# EAGLE design display_in4 (EAGLE 6.2)
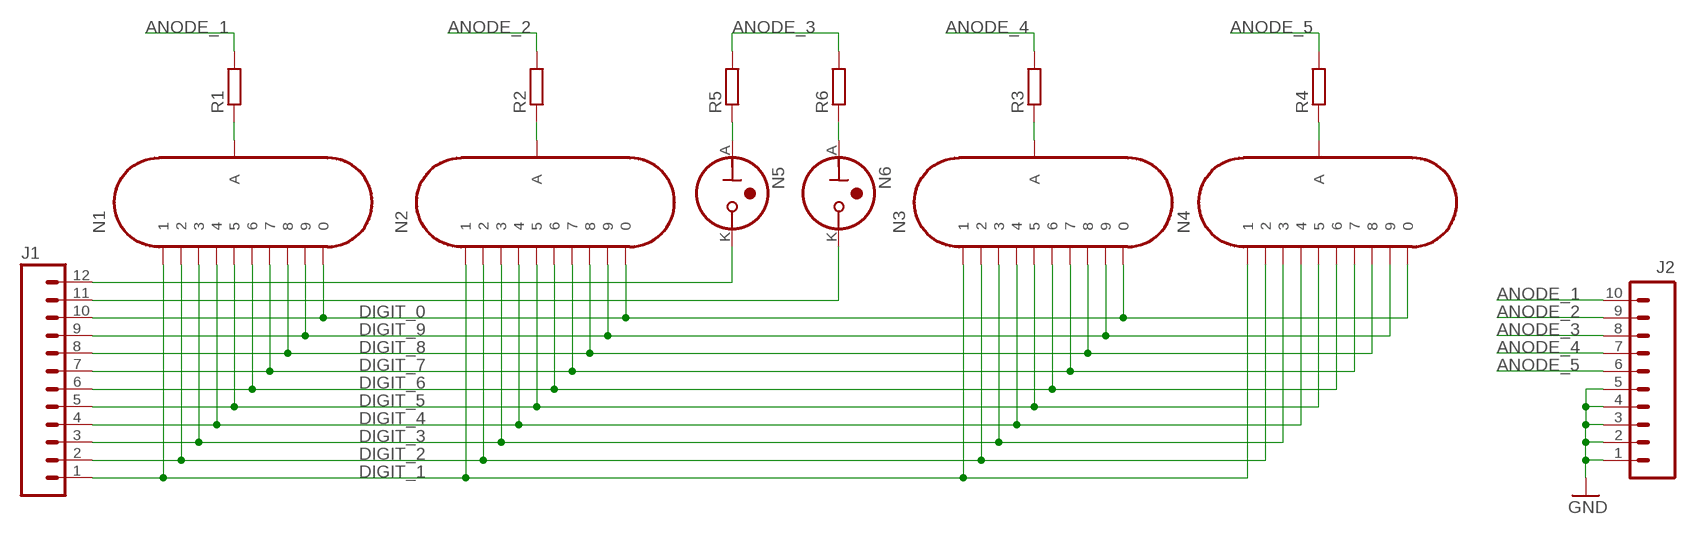
[diagram p0: schematic, sheet 1]

## Parts
J1  M12LOCK  [1X12_LOCK]
J2  M10LOCK  [1X10_LOCK]
N1  IN-4  [IN-4]
N2  IN-4  [IN-4]
N3  IN-4  [IN-4]
N4  IN-4  [IN-4]
N5  IN-6  [IN-6]
N6  IN-6  [IN-6]
R1  R-EU_0204/7  [0204/7]
R2  R-EU_0204/7  [0204/7]
R3  R-EU_0204/7  [0204/7]
R4  R-EU_0204/7  [0204/7]
R5  R-EU_0204/7  [0204/7]
R6  R-EU_0204/7  [0204/7]

## Nets
ANODE_1: J2.10 R1.2
ANODE_2: J2.9 R2.2
ANODE_3: J2.8 R5.2 R6.2
ANODE_4: J2.7 R3.2
ANODE_5: J2.6 R4.2
DIGIT_0: J1.10 N1.8 N2.8 N3.8 N4.8
DIGIT_1: J1.1 N1.14 N2.14 N3.14 N4.14
DIGIT_2: J1.2 N1.9 N2.9 N3.9 N4.9
DIGIT_3: J1.3 N1.11 N2.11 N3.11 N4.11
DIGIT_4: J1.4 N1.1 N2.1 N3.1 N4.1
DIGIT_5: J1.5 N1.12 N2.12 N3.12 N4.12
DIGIT_6: J1.6 N1.2 N2.2 N3.2 N4.2
DIGIT_7: J1.7 N1.6 N2.6 N3.6 N4.6
DIGIT_8: J1.8 N1.3 N2.3 N3.3 N4.3
DIGIT_9: J1.9 N1.5 N2.5 N3.5 N4.5
GND: J2.1 J2.2 J2.3 J2.4 J2.5
N$1: J1.12 N5.K
N$2: J1.11 N6.K
N$4: N6.A R6.1
N$5: N5.A R5.1
N$11: N1.4(A) R1.1
N$12: N2.4(A) R2.1
N$13: N3.4(A) R3.1
N$14: N4.4(A) R4.1

## Library data of the parts
J1 = SparkFun-Connectors:M12: Header 12 Standard 12-pin 0.1" header. Use with straight break away headers (SKU : PRT-00116), right angle break away headers (PRT-00553), swiss pins (PRT-00743), machine pins (PRT-00117), and female headers (PRT-00115).
J2 = SparkFun-Connectors:M10: Header 10 Standard 10-pin 0.1" header. Use with straight break away headers (SKU : PRT-00116), right angle break away headers (PRT-00553), swiss pins (PRT-00743), machine pins (PRT-00117), and female headers (PRT-00115).
N1-N4 = russian-nixies:IN-4: IN-4: large numeric topview nixie tube
N5 N6 = russian-nixies:IN-6: IN-6: dual nixie bulb
R1-R6 = resistor:R-EU_: RESISTOR, European symbol

## Board
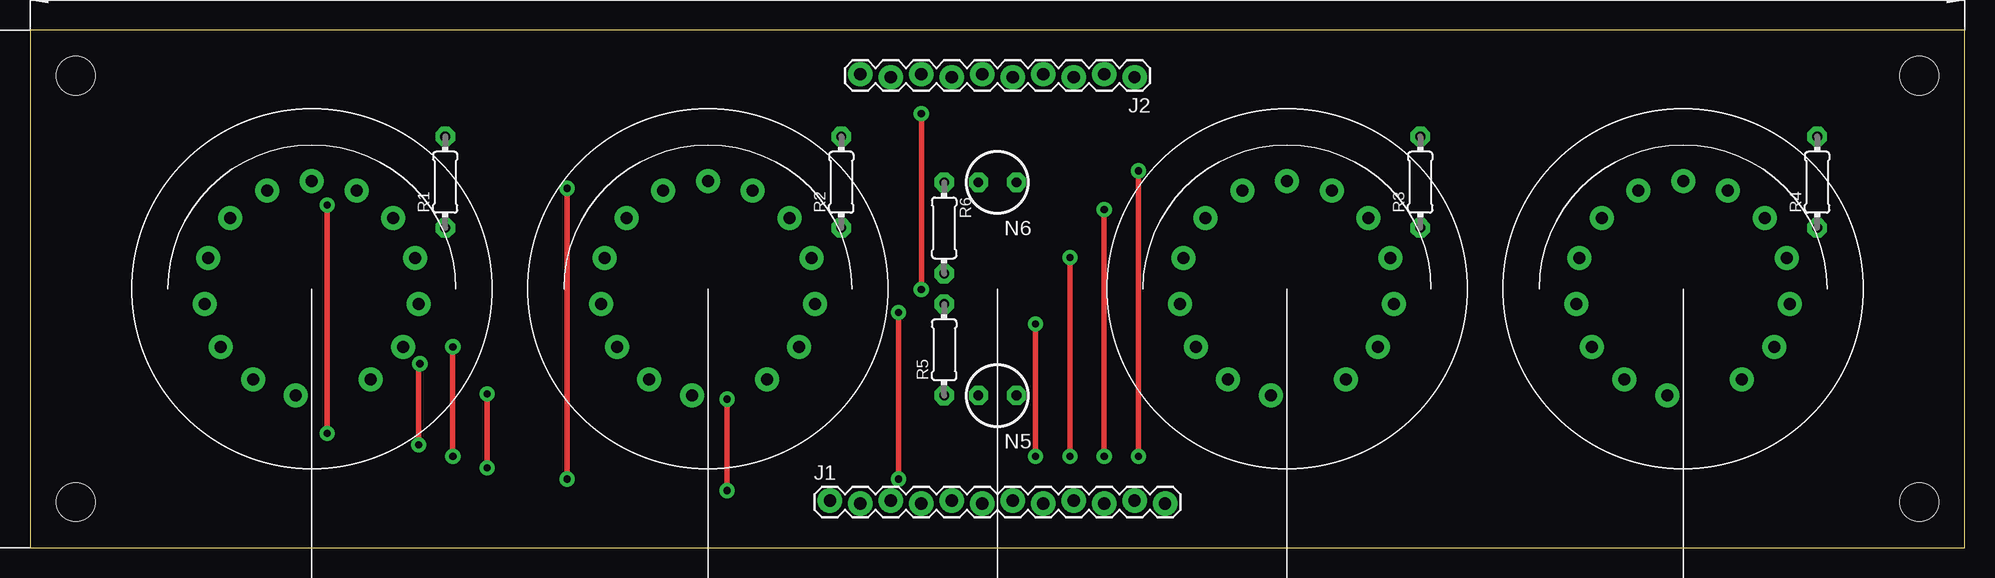
[diagram p1: board, top side]
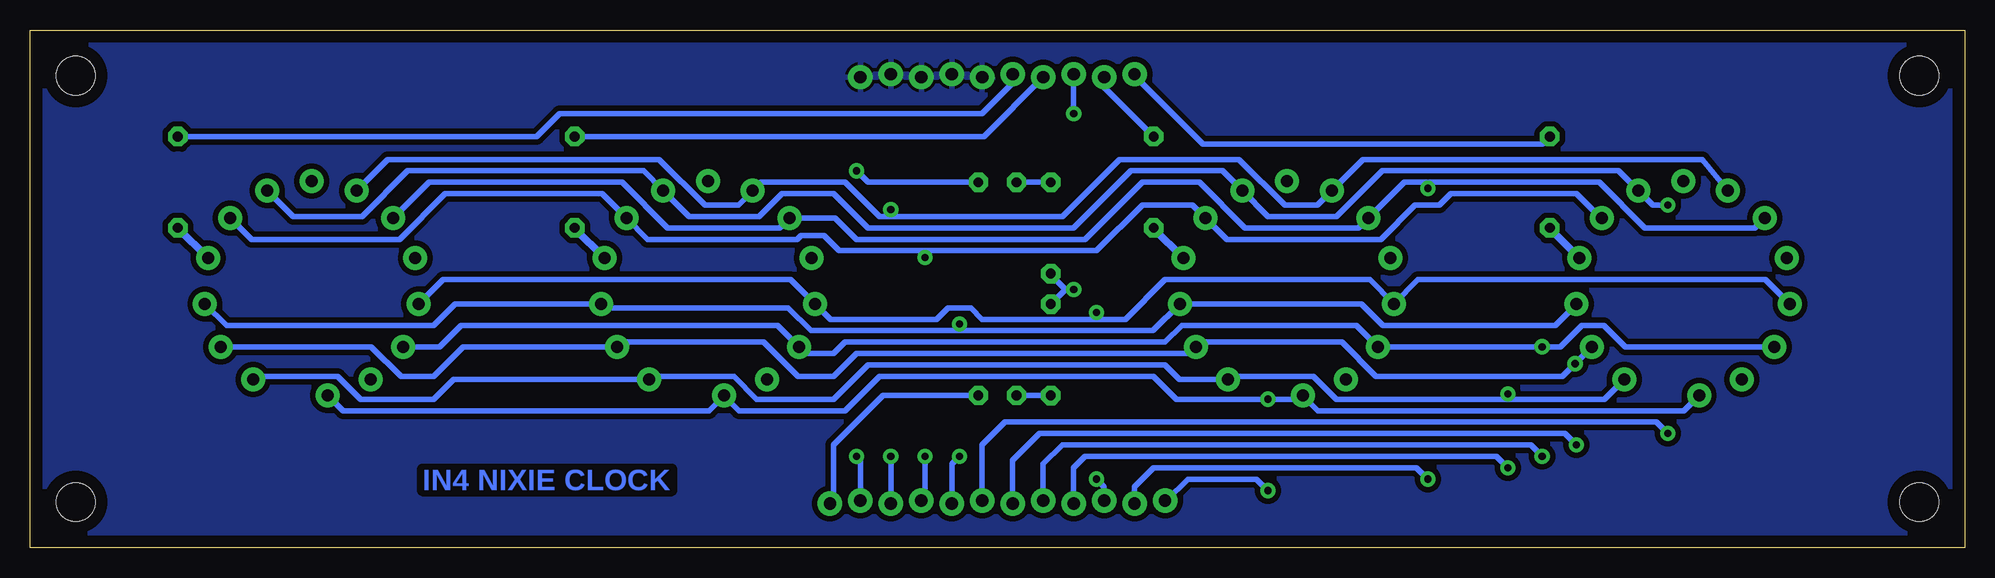
[diagram p2: board, bottom side, seen from below]

Size 161.29 x 43.18 mm. Coordinates in mm from the lower left corner, seen from the top.
Outline: 0,0 161.29,0 161.29,43.18 0,43.18 0,0
Copper layers (1*16): Top 0.035mm / dielectric 1.5mm / Bottom 0.035mm
Design rules: minimum track width 10mil, minimum drill 0.5mm, track to track 8mil, track to pad 8mil, pad to pad 8mil, via to via 8mil, smd to smd 8mil, copper to edge 40mil, drill to drill 8mil, minimum pad ring 10mil, minimum via ring 8mil, stop-mask expansion 4mil, vias tented up to drill 0mil, thermal gap 10mil
Holes 3.2 mm at 3.81,39.37 3.81,3.81 157.48,3.81 157.48,39.37

### Footprints (pad centres in the part's own frame; a part is rotated, then mirrored left to right if it is on the bottom)
1X12_LOCK = drill 1.016 pad 1.88: 1 0,0.127; 2 2.54,-0.127; 3 5.08,0.127; 4 7.62,-0.127; 5 10.16,0.127; 6 12.7,-0.127; 7 15.24,0.127; 8 17.78,-0.127; 9 20.32,0.127; 10 22.86,-0.127; 11 25.4,0.127; 12 27.94,-0.127
1X10_LOCK = drill 1.016 pad 1.88: 1 0,0.127; 2 2.54,-0.127; 3 5.08,0.127; 4 7.62,-0.127; 5 10.16,0.127; 6 12.7,-0.127; 7 15.24,0.127; 8 17.78,-0.127; 9 20.32,0.127; 10 22.86,-0.127
IN-4 = drill 1: 1 4.902,-7.548; 2 7.59,-4.836; 3 8.912,-1.253; 4 8.629,2.556; 5 6.792,5.904; 6 3.732,8.19; 7 0,9; 8 -3.732,8.19; 9 -6.792,5.904; 10 -8.629,2.556; 11 -8.912,-1.253; 12 -7.59,-4.836; 13 -4.902,-7.548; 14 -1.33,-8.901
IN-6 = drill 0.8 octagon: A -1.588,0; K 1.587,0
0204/7 = drill 0.813 octagon: 1 -3.81,0; 2 3.81,0

### Placement (x,y rotation side)
J1  66.67,3.81 0 top
J2  92.08,39.37 180 top
N1  23.5,21.59 0 top
N2  56.52,21.59 0 top
N3  104.78,21.59 0 top
N4  137.79,21.59 0 top
N5  80.64,12.7 0 top
N6  80.64,30.48 0 top
R1  34.61,30.48 90 top
R2  67.63,30.48 90 top
R3  115.89,30.48 90 top
R4  148.97,30.48 90 top
R5  76.2,16.51 90 top
R6  76.2,26.67 270 top

### Tracks (layer width: path | path; a pad name or v marks a point on that pad's centre or on a via)
ANODE_1
  Bottom 0.457: J2.10 69.22,39.37 63.5,33.66 35.24,33.66 R1.2
ANODE_2
  Bottom 0.457: J2.9 71.75,38.42 R2.2
ANODE_3  (via drill 0.6 pad 1.27)
  Top 0.457: v74.3,36.2 v74.3,21.53
  Bottom 0.457: J2.8 v74.3,36.2 | v74.3,21.53 74.99,21.53 | R6.2 76.2,22.73 74.99,21.53 | 74.99,21.53 R5.2
ANODE_4
  Bottom 0.457: J2.7 81.79,34.29 R3.2
ANODE_5
  Bottom 0.457: J2.6 79.38,38.73 81.92,36.2 117.16,36.2 119.06,34.29 R4.2
DIGIT_0  (via drill 0.6 pad 1.27)
  Top 0.457: v89.53,7.62 v89.53,28.19
  Bottom 0.457: N4.8 131.46,32.38 108.84,32.38 105.03,28.57 102.25,28.57 N3.8 100.34,30.48 93.34,30.48 90.49,27.62 89.53,27.62 | 89.53,27.62 75.25,27.62 70.48,32.38 60.52,32.38 56.71,28.57 53.99,28.57 N2.8 50.18,32.38 21.91,32.38 N1.8 | J1.10 v89.53,7.62 | v89.53,28.19 89.53,27.62
DIGIT_1  (via drill 0.6 pad 1.27)
  Top 0.457: v58.1,4.76 v58.1,12.38
  Bottom 0.457: N4.14 135.21,11.43 104.7,11.43 N3.14 102.19,11.43 93.34,11.43 90.49,14.29 67.63,14.29 65.72,12.38 v58.1,12.38 55.49,12.38 N2.14 53.93,11.43 23.42,11.43 N1.14 | v58.1,4.76 59.05,5.71 64.77,5.71 66.55,3.94 J1.1
DIGIT_2  (via drill 0.6 pad 1.27)
  Top 0.457: v44.77,5.71 v44.77,29.97
  Bottom 0.457: 44.77,30.48 30.48,30.48 26.67,26.67 17.53,26.67 N1.9 | 44.77,30.48 46.74,30.48 N2.9 50.55,26.67 60.01,26.67 63.82,30.48 68.58,30.48 73.34,25.72 92.39,25.72 94.17,27.49 N3.9 98.81,26.67 108.14,26.67 111.95,30.48 128.02,30.48 N4.9 | v44.77,5.71 45.72,6.67 67.63,6.67 69.22,5.08 J1.2 | v44.77,29.97 44.77,30.48
DIGIT_3  (via drill 0.6 pad 1.27)
  Top 0.457: v72.39,5.71 v72.39,19.62
  Bottom 0.457: N1.11 14.62,20.34 16.64,22.35 45.59,22.35 N2.11 49.62,22.35 66.67,22.35 69.98,19.05 72.39,19.05 | N4.11 126.87,22.35 97.88,22.35 N3.11 94.58,19.05 85.72,19.05 84.77,20 82.87,20 81.92,19.05 72.39,19.05 | J1.3 71.75,5.08 v72.39,5.71 | v72.39,19.62 72.39,19.05
DIGIT_4  (via drill 0.6 pad 1.27)
  Top 0.457: v38.1,6.67 v38.1,12.83
  Bottom 0.457: 38.1,12.38 30.06,12.38 N1.1 | 38.1,12.38 52.39,12.38 54.29,14.29 61.17,14.29 N2.1 65.48,14.04 66.67,15.24 91.44,15.24 94.3,12.38 100.71,12.38 102.62,14.29 109.43,14.29 N3.1 125.97,14.04 127.64,12.38 133.73,12.38 135.64,14.29 142.45,14.29 N4.1 | v38.1,6.67 39.05,7.62 73.34,7.62 74.3,6.67 J1.4 | v38.1,12.83 38.1,12.38
DIGIT_5  (via drill 0.6 pad 1.27)
  Top 0.457: v35.24,7.62 v35.24,16.75
  Bottom 0.457: N1.12 28.31,16.75 30.1,18.54 31.94,18.54 33.73,16.75 v35.24,16.75 N2.12 50.71,18.54 65.28,18.54 66.67,17.14 93.34,17.14 94.3,16.19 96.62,16.19 N3.12 98.97,18.54 125.35,18.54 127.14,16.75 N4.12 | v35.24,7.62 36.2,8.57 75.25,8.57 76.83,6.99 J1.5
DIGIT_6  (via drill 0.6 pad 1.27)
  Top 0.457: v32.38,8.57 32.38,15.24 v32.49,15.35
  Bottom 0.457: N4.2 132.83,16.75 130.37,14.29 127.64,14.29 125.17,16.75 N3.2 111.97,17.14 100.14,17.14 97.28,14.29 94.3,14.29 92.39,16.19 64.67,16.19 N2.2 63.72,17.14 51.94,17.14 49.09,14.29 33.55,14.29 v32.49,15.35 N1.2 | v32.38,8.57 33.34,9.53 77.15,9.53 79.38,7.3 J1.6
DIGIT_7  (via drill 0.6 pad 1.27)
  Top 0.457: v24.77,9.53 v24.77,28.57
  Bottom 0.457: N1.6 28.88,31.43 48.58,31.43 52.39,27.62 58.09,27.62 N2.6 61.9,31.43 69.53,31.43 74.3,26.67 91.44,26.67 94.3,29.53 98.61,29.53 100.52,27.62 106.35,27.62 N3.6 110.16,31.43 129.79,31.43 133.6,27.62 139.37,27.62 N4.6 | v24.77,9.53 25.72,10.48 80.01,10.48 81.92,8.57 J1.7 | 26.98,29.53 N1.6 | v24.77,28.57 26.02,28.57 N1.6
DIGIT_8  (via drill 0.6 pad 1.27)
  Top 0.457: v83.82,7.62 v83.82,18.67
  Bottom 0.457: N1.3 32.41,20.3 34.16,18.54 48.51,18.54 50.31,20.34 N2.3 67.67,18.1 83.82,18.1 | N4.3 144.91,18.54 127.64,18.54 125.84,20.34 N3.3 113.35,20 98.11,20 96.2,18.1 83.82,18.1 | J1.8 84.45,6.99 v83.82,7.62 | v83.82,18.67 83.82,18.1
DIGIT_9  (via drill 0.6 pad 1.27)
  Top 0.457: v86.68,7.62 v86.68,24.19
  Bottom 0.457: 86.68,24.77 93.85,24.77 95.12,26.04 97.03,26.04 97.35,25.72 109.79,25.72 N3.5 113.6,29.53 126.68,29.53 130.49,25.72 142.81,25.72 N4.5 | 86.68,24.77 72.39,24.77 68.58,28.57 64.39,28.57 N2.5 61.53,25.72 48.7,25.72 45.85,28.57 43.81,28.57 42.86,29.53 32.38,29.53 30.35,27.49 N1.5 | v86.68,24.19 86.68,24.77 | v86.68,7.62 86.68,4.25 J1.9
GND
  pour Bottom (isolate 0.457): 0,43.18 161.29,43.18 161.29,0 0,0
N$1
  Bottom 0.457: N5.K 90.17,12.7 94.3,8.57 94.3,4 J1.12
N$2  (via drill 0.6 pad 1.27)
  Top 0.457: v92.39,7.62 v92.39,31.43
  Bottom 0.457: J1.11 92.08,7.3 v92.39,7.62 | v92.39,31.43 91.44,30.48 N6.K
N$4
  Bottom 0.457: R6.1 N6.A
N$5
  Bottom 0.457: R5.1 N5.A
N$11
  Bottom 0.61: R1.1 34.61,26.63 N1.4
N$12
  Bottom 0.61: R2.1 67.63,26.63 N2.4
N$13
  Bottom 0.61: R3.1 115.89,26.63 N3.4
N$14
  Bottom 0.61: N4.4 146.45,24.15 R4.1

### Text on the board
Bottom: IN4 NIXIE CLOCK